# EAGLE schematic Boost Converter Circuit (EAGLE 9.6.2)
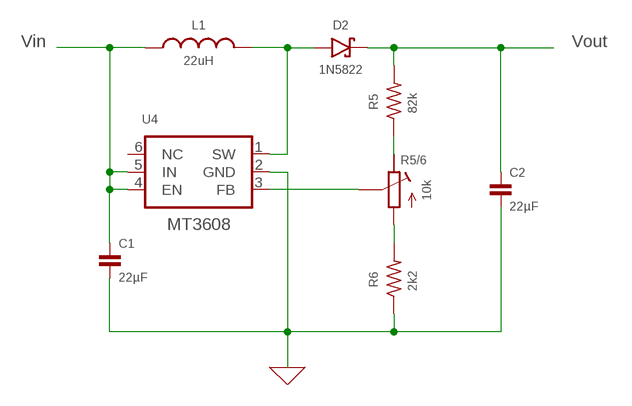
[diagram p0: schematic, sheet 1]

## Parts
C1  22µF  CAPACITOR-1206  [C1206]
C2  22µF  CAPACITOR-1206  [C1206]
D2  1N5822  DIODE-SCHOTTKY-1N5822  [DIODE_SMB]
L1  22uH  INDUCTOR-CDRH104R/6D28L5038P  [CDRH104R+6D28]
R5  82k  RESISTORR0805  [R0805]
R5/6  10k  RESISTOR-TRIMM-BAOTER-HORIZONTAL  [RTRIM64P]
R6  2k2  RESISTORR0805  [R0805]
U4  MT3608  [SOT-23-6]

## Nets
0: C1.2 C2.2 R6.1 U4.2(GND) ; supply symbol labelled GND
N$6: D2.A L1.1 U4.1(SW)
N$13: R5.1 R5/6.3(E)
N$27: R5/6.1(A) R6.2
N$31: R5/6.2(S) U4.3(FB)
N$32: C2.1 D2.C R5.2
N$39: C1.1 L1.2 U4.4(EN) U4.5(IN)
Unconnected: U4.6(NC)

## Notes on the sheet
- Vin | Vout

## Library data of the parts
C1 C2 = digitalconcepts:CAPACITOR-1206: 1206 Capacitor
D2 = digitalconcepts:DIODE-SCHOTTKY-1N5822: 1N5822 Schottky Diode SMB
L1 = digitalconcepts:INDUCTOR-CDRH104R/6D28: Inductor; SPICEPREFIX: L
R5 R6 = digitalconcepts:RESISTOR: Resistor; SPICEPREFIX: R
R5/6 = digitalconcepts:RESISTOR-TRIMM-BAOTER-HORIZONTAL: Trimm Resistor - Horizontal BAOTER
U4 = digitalconcepts:MT3608: MT3608 DC-DC Step-Up Voltage Converter